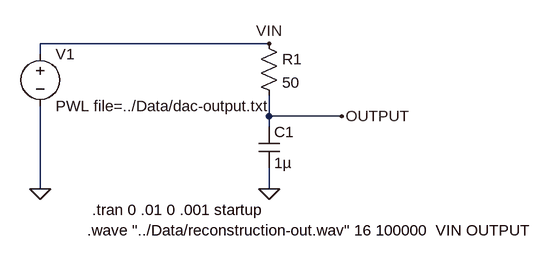
[diagram p0: schematic Reconstruction-Filter.asc]
Reconstruction-Filter.asc, the LTspice schematic file:
Version 4
SHEET 1 880 680
WIRE 80 64 -272 64
WIRE -272 80 -272 64
WIRE 80 176 80 144
WIRE 192 176 80 176
WIRE 80 192 80 176
WIRE -272 288 -272 160
WIRE 80 288 80 256
FLAG 192 176 OUTPUT
FLAG 80 288 0
FLAG -272 288 0
FLAG 80 64 VIN
SYMBOL res 64 48 R0
SYMATTR InstName R1
SYMATTR Value 50
SYMATTR SpiceLine tol=1 pwr=0.1
SYMBOL cap 64 192 R0
SYMATTR InstName C1
SYMATTR Value 1µ
SYMATTR SpiceLine V=4 Irms=0 Rser=0 Lser=0
SYMBOL voltage -272 64 R0
WINDOW 123 0 0 Left 0
WINDOW 39 0 0 Left 0
SYMATTR InstName V1
SYMATTR Value PWL file=../Data/dac-output.txt
TEXT -200 352 Left 2 !.wave "../Data/reconstruction-out.wav" 16 100000  VIN OUTPUT
TEXT -192 320 Left 2 !.tran 0 .01 0 .001 startup

The netlist it stands for:
* Reconstruction-Filter.asc
R1 VIN OUTPUT 50 tol=1 pwr=0.1
C1 OUTPUT 0 1µ V=4 Irms=0 Rser=0 Lser=0
V1 VIN 0 PWL file=../Data/dac-output.txt
.wave "../Data/reconstruction-out.wav" 16 100000  VIN OUTPUT
.tran 0 .01 0 .001 startup
.backanno
.end

* Results of the author's LTspice run, read from the files saved beside the schematic
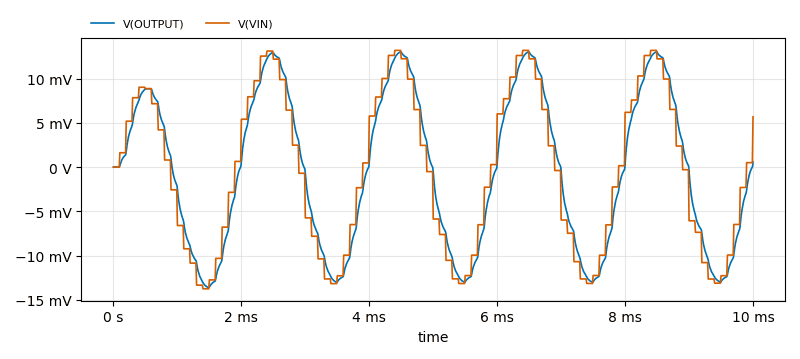
[diagram p1: Transient Analysis of Reconstruction-Filter.asc, plotted from the saved traces]
* Transient Analysis, 1 run:
*   V(OUTPUT): min -13.64 mV, max 13.08 mV, average -445.5 µV, rms 8.744 mV, last 581.8 µV
*   V(VIN): min -13.75 mV, max 13.21 mV, average -442.7 µV, rms 8.887 mV, last 5.697 mV